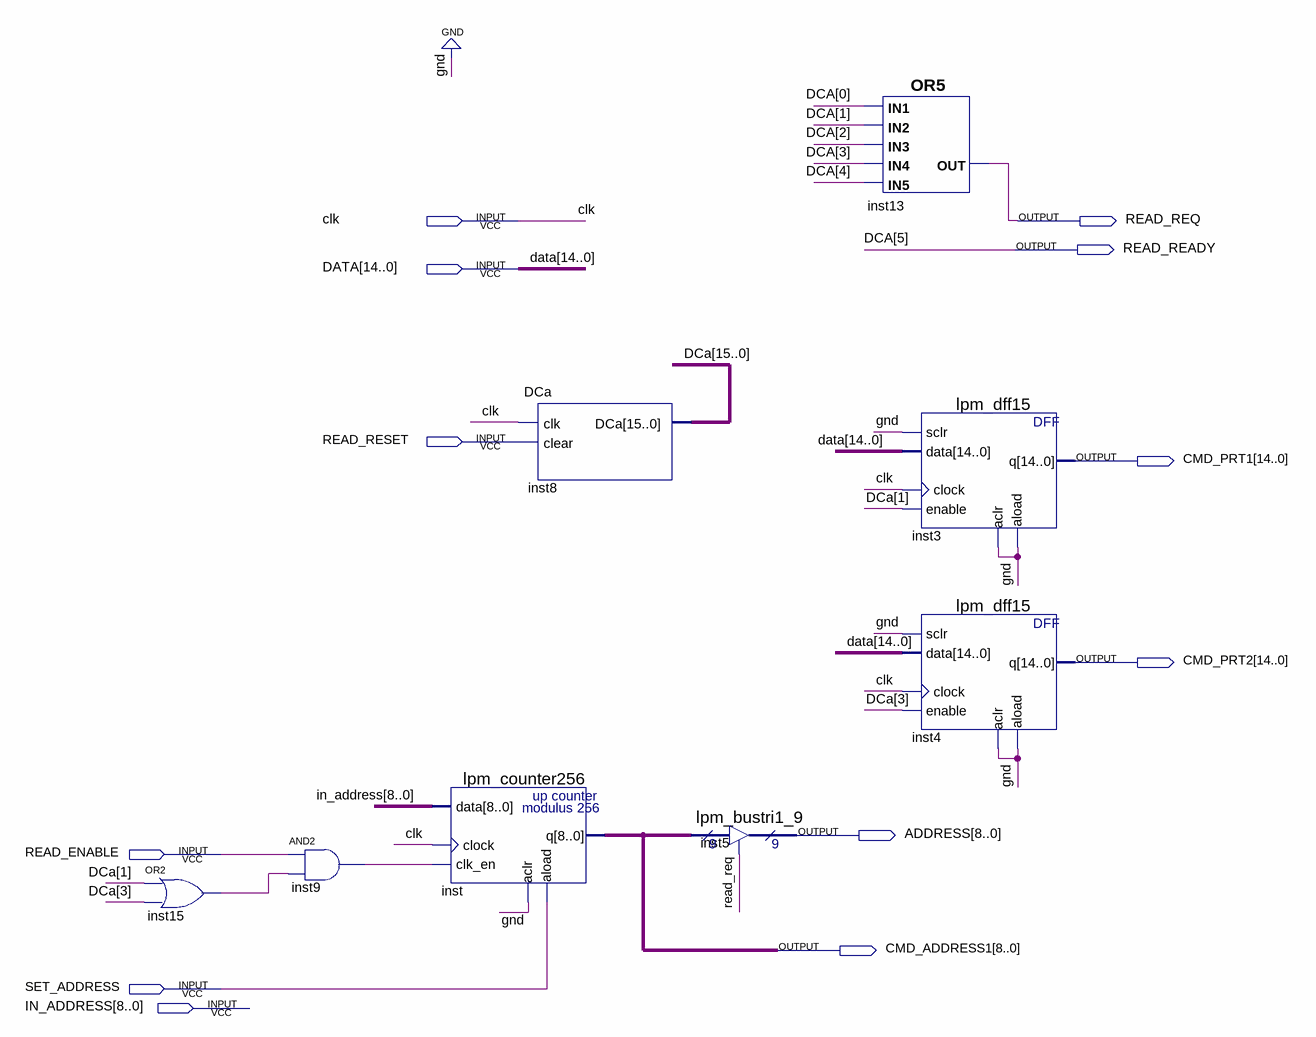
[diagram p0: schematic sheet]
// Quartus schematic COMMAND_READER.bdf as structural Verilog: 8 symbols, 12 pins
module COMMAND_READER (
  input  clk,
  input  [14:0] DATA,
  input  READ_RESET,
  input  READ_ENABLE,
  input  SET_ADDRESS,
  input  [8:0] IN_ADDRESS,
  output READ_REQ,
  output READ_READY,
  output [14:0] CMD_PRT1,
  output [14:0] CMD_PRT2,
  output [8:0] ADDRESS,
  output [8:0] CMD_ADDRESS1
);

  wire inst9_out, inst15_out;
  wire [15:0] DCa;

  or inst15 (inst15_out, DCa[1], DCa[3]);
  and inst9 (inst9_out, READ_ENABLE, inst15_out);
  lpm_counter256 inst (
    .data(IN_ADDRESS), .clock(clk), .clk_en(inst9_out), .aclr(1'b0), .aload(SET_ADDRESS), .q(CMD_ADDRESS1));
  DCa inst8 (.clk(clk), .clear(READ_RESET), .DCa({DCa[15:6], READ_READY, DCa[4:0]}));
  lpm_bustri1_9 inst5 (.enabledt(READ_REQ), .data(CMD_ADDRESS1), .tridata(ADDRESS));
  or inst13 (READ_REQ, DCa[0], DCa[1], DCa[2], DCa[3], DCa[4]);
  lpm_dff15 inst3 (.sclr(1'b0), .data(DATA), .clock(clk), .enable(DCa[1]), .aclr(1'b0), .aload(1'b0), .q(CMD_PRT1));
  lpm_dff15 inst4 (.sclr(1'b0), .data(DATA), .clock(clk), .enable(DCa[3]), .aclr(1'b0), .aload(1'b0), .q(CMD_PRT2));

  // Other names for the same wires on the sheet: DCa[5] = READ_READY
endmodule
